# EAGLE schematic STEP800_r1_0_0 (EAGLE 9.6.2)

## Sheet 1 of 3
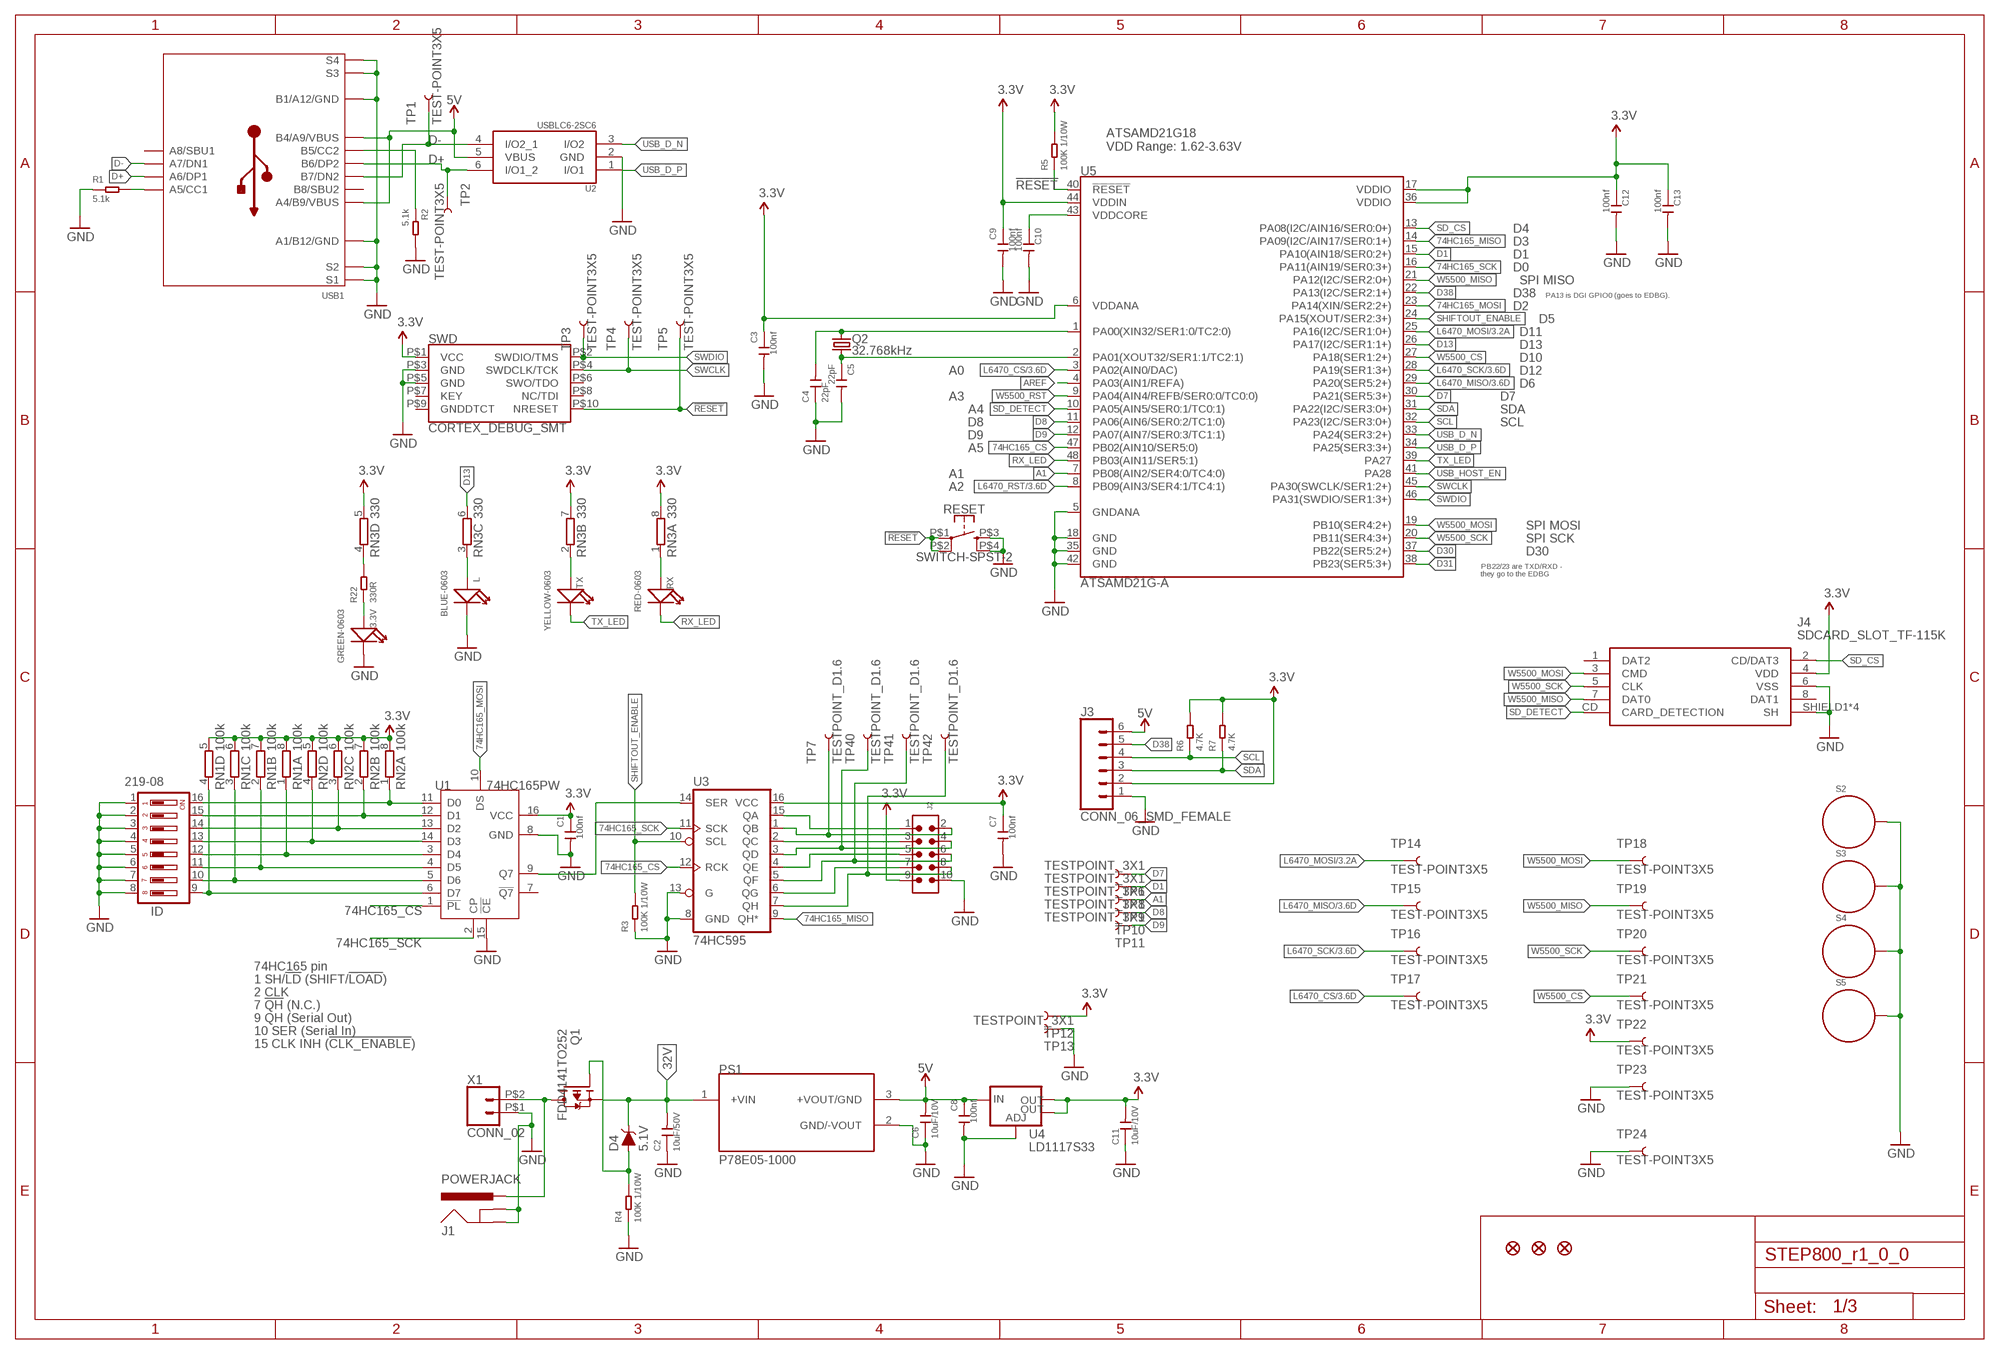
[diagram p0: schematic, sheet 1]

### Parts
3.3V  GREEN-0603  SMD-LED-CLEAR-GREEN(0603)  [LED-0603]
C1  100nf  CERAMIC-100NF-25V-10%-X7R(0402)  [C0402]
C2  10uF/50V  CERAMIC-10UF-25V-10%-X5R(1206)  [C1206]
C3  100nf  CERAMIC-100NF-25V-10%-X7R(0402)  [C0402]
C4  22pF  CERAMIC-15PF-50V-5%-NPO(0402)  [C0402]
C5  22pF  CERAMIC-15PF-50V-5%-NPO(0402)  [C0402]
C6  10uF/10V  CERAMIC-22UF-16V-10%-X7R(1206)  [C1206]
C7  100nf  CERAMIC-100NF-25V-10%-X7R(0402)  [C0402]
C8  100nf  CERAMIC-100NF-25V-10%-X7R(0402)  [C0402]
C9  100nf  CERAMIC-100NF-25V-10%-X7R(0402)  [C0402]
C10  100nf  CERAMIC-100NF-25V-10%-X7R(0402)  [C0402]
C11  10uF/10V  CERAMIC-10UF-10V-(-20%～+80%)-Y5V(0805)  [C0805]
C12  100nf  CERAMIC-100NF-25V-10%-X7R(0402)  [C0402]
C13  100nf  CERAMIC-100NF-25V-10%-X7R(0402)  [C0402]
D4  5.1V  DIODE-ZENER-MM3Z3V3T1G  [SOD-323]
FD1  FIDUCIAL1X2  [FIDUCIAL-1X2]
FD2  FIDUCIAL1X2  [FIDUCIAL-1X2]
FD3  FIDUCIAL1X2  [FIDUCIAL-1X2]
ID  219-08  [CTS-219-08]
J1  POWERJACK  [POWERJACK_SLOT]
J2  6120XX21621_61201021621  [61201021621]
J3  CONN_06_SMD_FEMALE  [1X06-SMD-FEMALE]
J4  SDCARD_SLOT_TF-115K  [TF-115K]
L  BLUE-0603  SMD-LED-CLEAR-BLUE(0603)  [LED-0603]
PS1  P78E05-1000  [CONV_P78E05-1000]
Q1  FDD4141TO252  [TO252]
Q2  32.768kHz  CRYSTALFC-135  [FC-135]
R1  5.1k  SMD-RES-5.1K-1%-1/10W(0603)  [R0603]
R2  5.1k  SMD-RES-5.1K-1%-1/10W(0603)  [R0603]
R3  100K 1/10W  SMD-RES-10K-5%-1/10W(0603)  [R0603]
R4  100K 1/10W  SMD-RES-100K-5%-1/10W(0603)  [R0603]
R5  100K 1/10W  SMD-RES-10K-5%-1/10W(0603)  [R0603]
R6  4.7K  SMD-RES-4.7K-5%-1/10W(0603)  [R0603]
R7  4.7K  SMD-RES-4.7K-5%-1/10W(0603)  [R0603]
R22  330R  SMD-RES-330R-1%-1/10W(0603)  [R0603]
RESET  SWITCH-SPST-2  [SKRP]
RN1  100k  4R-NCAY16_LONG_W  [CAY16_LONG_W]
RN2  100k  4R-NCAY16_LONG_W  [CAY16_LONG_W]
RN3  330  4R-NCAY16_LONG_W  [CAY16_LONG_W]
RX  RED-0603  LED-SMD-RED-DIFFUSED(0603)  [LED-0603]
S2  STANDOFF_ELECTRICAL  [STANDOFF-ELECTRICAL]
S3  STANDOFF_ELECTRICAL  [STANDOFF-ELECTRICAL]
S4  STANDOFF_ELECTRICAL  [STANDOFF-ELECTRICAL]
S5  STANDOFF_ELECTRICAL  [STANDOFF-ELECTRICAL]
SWD  CORTEX_DEBUG_SMT  [20021121-00010C4LF]
TP1  TEST-POINT3X5  [PAD.03X.05]
TP2  TEST-POINT3X5  [PAD.03X.05]
TP3  TEST-POINT3X5  [PAD.03X.05]
TP4  TEST-POINT3X5  [PAD.03X.05]
TP5  TEST-POINT3X5  [PAD.03X.05]
TP6  TESTPOINT_3X1  [TESTPOINT_3X1]
TP7  TESTPOINT_D1.6  [TESTPOINT_D1.6]
TP8  TESTPOINT_3X1  [TESTPOINT_3X1]
TP9  TESTPOINT_3X1  [TESTPOINT_3X1]
TP10  TESTPOINT_3X1  [TESTPOINT_3X1]
TP11  TESTPOINT_3X1  [TESTPOINT_3X1]
TP12  TESTPOINT_3X1  [TESTPOINT_3X1]
TP13  TESTPOINT_3X1  [TESTPOINT_3X1]
TP14  TEST-POINT3X5  [PAD.03X.05]
TP15  TEST-POINT3X5  [PAD.03X.05]
TP16  TEST-POINT3X5  [PAD.03X.05]
TP17  TEST-POINT3X5  [PAD.03X.05]
TP18  TEST-POINT3X5  [PAD.03X.05]
TP19  TEST-POINT3X5  [PAD.03X.05]
TP20  TEST-POINT3X5  [PAD.03X.05]
TP21  TEST-POINT3X5  [PAD.03X.05]
TP22  TEST-POINT3X5  [PAD.03X.05]
TP23  TEST-POINT3X5  [PAD.03X.05]
TP24  TEST-POINT3X5  [PAD.03X.05]
TP40  TESTPOINT_D1.6  [TESTPOINT_D1.6]
TP41  TESTPOINT_D1.6  [TESTPOINT_D1.6]
TP42  TESTPOINT_D1.6  [TESTPOINT_D1.6]
TX  YELLOW-0603  SMD-LED-CLEAR-YELLOW(0603)  [LED-0603]
U1  74HC165PW  [TSSOP16]
U2  USBLC6-2SC6  [SOT23-6L]
U3  74HC595  74595  [TSSOP16]
U4  LD1117S33  V_REG_LM1117SOT223  [SOT223]
U5  ATSAMD21G-A  [TQFP-48]
USB1  USB-C_USB2.0-TYPE-C  [USB-C_USB2.0-TYPE-C]
X1  CONN_02  [WJ25C-B-7.62-2P]

### Nets
3.3V [GND_]: C1.1 C3.1 C7.1 C9.1 C11.2 C12.1 C13.1 J2.9 J3.2 J4.4(VDD) R5.2 R6.2 R7.2 RN1.5 RN1.6 RN1.7 RN1.8 RN2.5 RN2.6 RN2.7 RN2.8 RN3.5 RN3.7 RN3.8 SWD.P$1(VCC) TP12.P$1 TP22.P$1 U1.16(VCC) U3.16(VCC) U4.2(OUT) U4.4(OUT) U5.6(VDDANA) U5.17(VDDIO) U5.36(VDDIO) U5.44(VDDIN) ; also sheet 2,3
5V: C6.2 C8.1 J3.6 PS1.3(+VOUT/GND) U2.5(VBUS) U4.3(IN) USB1.A4_B9(A4/B9/VBUS) USB1.B4_A9(B4/A9/VBUS) ; also sheet 3
32V: C2.2 D4.C PS1.1(+VIN) Q1.2(S) ; also sheet 3
74HC165_CS: U1.1(!PL) U3.12(RCK) U5.47(PB02(AIN10/SER5:0))
74HC165_MISO: U3.9(QH*) U5.14(PA09(I2C/AIN17/SER0:1+))
74HC165_MOSI: U1.10(DS) U5.23(PA14(XIN/SER2:2+))
74HC165_SCK: U1.2(CP) U3.11(SCK) U5.16(PA11(AIN19/SER0:3+))
!RESET: R5.1 RESET.P$1 RESET.P$2 SWD.P$10(NRESET) TP5.P$1 U5.40(!RESET!)
A1: TP9.P$1 U5.7(PB08(AIN2/SER4:0/TC4:0))
AREF: U5.4(PA03(AIN1/REFA))
D1: TP8.P$1 U5.15(PA10(AIN18/SER0:2+))
D7: TP6.P$1 U5.30(PA21(SER5:3+))
D8: TP10.P$1 U5.11(PA06(AIN6/SER0:2/TC1:0))
D9: TP11.P$1 U5.12(PA07(AIN7/SER0:3/TC1:1))
D13: RN3.6 U5.26(PA17(I2C/SER1:1+))
D30: U5.37(PB22(SER5:2+))
D31: U5.38(PB23(SER5:3+))
D38: J3.5 U5.22(PA13(I2C/SER2:1+))
D+: TP2.P$1 U2.6(I/O1_2) USB1.A6(A6/DP1) USB1.B6(B6/DP2)
D-: TP1.P$1 U2.4(I/O2_1) USB1.A7(A7/DN1) USB1.B7(B7/DN2)
GND: 3.3V.- C1.2 C2.1 C3.2 C4.1 C5.2 C6.1 C7.2 C8.2 C9.2 C10.2 C11.1 C12.2 C13.2 ID.1 ID.2 ID.3 ID.4 ID.5 ID.6 ID.7 ID.8 J1.P$33(GNDBREAK) J1.P$34(GNDBREAK) J1.P$35(GNDBREAK) J1.P$36(GNDBREAK) J1.P$37(GNDBREAK) J1.P$38(GNDBREAK) J1.P$39(GNDBREAK) J1.P$40(GNDBREAK) J1.P$41(GNDBREAK) J1.P$42(GNDBREAK) J1.P$43(GNDBREAK) J1.P$44(GNDBREAK) J1.P$45(GNDBREAK) J1.P$46(GNDBREAK) J1.P$47(GNDBREAK) J1.P$48(GNDBREAK) J1.P$49(GNDBREAK) J1.P$50(GNDBREAK) J1.P$51(GNDBREAK) J1.P$52(GNDBREAK) J1.P$53(GNDBREAK) J1.P$54(GNDBREAK) J1.P$55(GNDBREAK) J1.P$56(GNDBREAK) J1.P$63(GND) J1.P$64(GND) J1.P$65(GND) J1.P$66(GND) J1.P$67(GND) J1.P$68(GND) J1.P$69(GND) J1.P$70(GND) J1.P$71(GND) J1.P$72(GND) J1.P$73(GND) J1.P$74(GND) J1.P$75(GND) J1.P$76(GND) J1.P$77(GND) J1.P$78(GND) J1.P$79(GND) J1.P$80(GND) J1.P$81(GND) J1.P$82(GND) J1.P$83(GND) J1.P$84(GND) J1.P$85(GND) J2.10 J3.1 J4.6(VSS) J4.SHIELD1(SH) J4.SHIELD2(SH) J4.SHIELD3(SH) J4.SHIELD4(SH) L.- PS1.2(GND/-VOUT) R1.1 R2.2 R3.1 R4.1 RESET.P$3 RESET.P$4 S2.P1 S3.P1 S4.P1 S5.P1 SWD.P$3(GND) SWD.P$5(GND) TP13.P$1 TP23.P$1 TP24.P$1 U1.8(GND) U1.15(!CE) U2.2(GND) U3.8(GND) U3.13(G) U4.1(ADJ) U5.5(GNDANA) U5.18(GND) U5.35(GND) U5.42(GND) USB1.A1_B12(A1/B12/GND) USB1.B1_A12(B1/A12/GND) USB1.S7(S1) USB1.S8(S1) USB1.S9(S1) USB1.S10(S1) USB1.S11(S1) USB1.S12(S1) USB1.S13(S1) USB1.S14(S1) USB1.S15(S1) USB1.S16(S3) USB1.S17(S3) USB1.S18(S3) USB1.S19(S3) USB1.S20(S3) USB1.S21(S3) USB1.S22(S3) USB1.S23(S3) USB1.S24(S3) USB1.S25(S3) USB1.S26(S3) USB1.S27(S3) USB1.S29(S2) USB1.S30(S2) USB1.S31(S2) USB1.S32(S2) USB1.S33(S2) USB1.S34(S2) USB1.S35(S2) USB1.S36(S2) USB1.S37(S4) USB1.S38(S4) USB1.S39(S4) USB1.S40(S4) USB1.S41(S4) USB1.S42(S4) USB1.S43(S4) USB1.S44(S4) USB1.S45(S4) USB1.S46(S4) USB1.S47(S4) USB1.S48(S4) X1.P$1 ; also sheet 2,3
L6470_CS: TP17.P$1 U5.3(PA02(AIN0/DAC)) ; also sheet 3
L6470_MISO: TP15.P$1 U5.29(PA20(SER5:2+)) ; also sheet 3
L6470_MOSI: TP14.P$1 U5.25(PA16(I2C/SER1:0+)) ; also sheet 3
L6470_RST: U5.8(PB09(AIN3/SER4:1/TC4:1)) ; also sheet 3
L6470_SCK: TP16.P$1 U5.28(PA19(SER1:3+)) ; also sheet 3
N$3: C4.2 Q2.P$2 U5.1(PA00(XIN32/SER1:0/TC2:0))
N$10: ID.16 RN2.1 U1.11(D0)
N$11: D4.A Q1.1(G) R4.2
N$12: ID.15 RN2.2 U1.12(D1)
N$13: ID.14 RN2.3 U1.13(D2)
N$14: C5.1 Q2.P$1 U5.2(PA01(XOUT32/SER1:1/TC2:1))
N$15: U1.9(Q7) U3.14(SER)
N$16: RN3.1 RX.+
N$17: ID.13 RN2.4 U1.14(D3)
N$18: ID.12 RN1.1 U1.3(D4)
N$19: ID.11 RN1.2 U1.4(D5)
N$25: RN3.2 TX.+
N$26: L.+ RN3.3
N$27: R22.2 RN3.4
N$28: J2.3 U3.2(QC)
N$33: ID.10 RN1.3 U1.5(D6)
N$34: J2.2 TP7.1 U3.1(QB)
N$36: J2.1 U3.15(QA)
N$38: ID.9 RN1.4 U1.6(D7)
N$40: J2.4 TP40.1 U3.3(QD)
N$41: J2.5 U3.4(QE)
N$42: J2.6 TP41.1 U3.5(QF)
N$43: J2.7 U3.6(QG)
N$44: J2.8 TP42.1 U3.7(QH)
N$45: R2.1 USB1.B5(B5/CC2)
N$46: 3.3V.+ R22.1
N$50: R1.2 USB1.A5(A5/CC1)
RX_LED: RX.- U5.48(PB03(AIN11/SER5:1))
SCL: J3.4 R6.1 U5.32(PA23(I2C/SER3:0+))
SD_CS: J4.2(CD/DAT3) U5.13(PA08(I2C/AIN16/SER0:0+))
SD_DETECT: J4.CD(CARD_DETECTION) U5.10(PA05(AIN5/SER0:1/TC0:1))
SDA: J3.3 R7.1 U5.31(PA22(I2C/SER3:0+))
SHIFTOUT_ENABLE: R3.2 U3.10(SCL) U5.24(PA15(XOUT/SER2:3+))
SWCLK: SWD.P$4(SWDCLK/TCK) TP4.P$1 U5.45(PA30(SWCLK/SER1:2+))
SWDIO: SWD.P$2(SWDIO/TMS) TP3.P$1 U5.46(PA31(SWDIO/SER1:3+))
TX_LED: TX.- U5.39(PA27)
USB_D_N: U2.3(I/O2) U5.33(PA24(SER3:2+))
USB_D_P: U2.1(I/O1) U5.34(PA25(SER3:3+))
USB_HOST_EN: U5.41(PA28)
VDDCORE1: C10.1 U5.43(VDDCORE)
VRAW: J1.P$2(PWR) J1.P$3(PWR) J1.P$4(PWR) J1.P$5(PWR) J1.P$6(PWR) J1.P$7(PWR) J1.P$8(PWR) J1.P$9(PWR) J1.P$10(PWR) J1.P$11(PWR) J1.P$12(PWR) J1.P$13(PWR) J1.P$14(PWR) J1.P$15(PWR) J1.P$16(PWR) J1.P$17(PWR) J1.P$18(PWR) J1.P$19(PWR) J1.P$20(PWR) J1.P$21(PWR) J1.P$22(PWR) J1.P$23(PWR) J1.P$24(PWR) J1.P$25(PWR) J1.P$26(PWR) J1.P$27(PWR) J1.P$28(PWR) Q1.3(D) X1.P$2
W5500_CS: TP21.P$1 U5.27(PA18(SER1:2+)) ; also sheet 2
W5500_MISO: J4.7(DAT0) TP19.P$1 U5.21(PA12(I2C/SER2:0+)) ; also sheet 2
W5500_MOSI: J4.3(CMD) TP18.P$1 U5.19(PB10(SER4:2+)) ; also sheet 2
W5500_RST: U5.9(PA04(AIN4/REFB/SER0:0/TC0:0)) ; also sheet 2
W5500_SCK: J4.5(CLK) TP20.P$1 U5.20(PB11(SER4:3+)) ; also sheet 2
Unconnected: J4.1(DAT2) J4.8(DAT1) SWD.P$6(SWO/TDO) SWD.P$7(KEY) SWD.P$8(NC/TDI) SWD.P$9(GNDDTCT) U1.7(!Q7) USB1.A8(A8/SBU1) USB1.B8(B8/SBU2)

### Notes on the sheet
- ATSAMD21G18
  VDD Range: 1.62-3.63V
- D4
- D3
- D1
- D0
- SPI MISO
- D38 | PA13 is DGI GPIO0 (goes to EDBG).
- D2
- D5
- D11
- D13
- D10
- A0 | D12
- D6
- A3 | D7
- A4 | SDA
- D8 | SCL
- D9
- A5
- A1
- A2
- SPI MOSI
- SPI SCK
- D30
- PB22/23 are TXD/RXD - 
  they go to the EDBG
- 74HC165 pin
- 1 SH/!LD! (SHIFT/!LOAD!)
- 2 CLK
- 7 !QH! (N.C.)
- 9 QH (Serial Out)
- 10 SER (Serial In)
- 15 CLK INH (!CLK_ENABLE!)

## Sheet 2 of 3
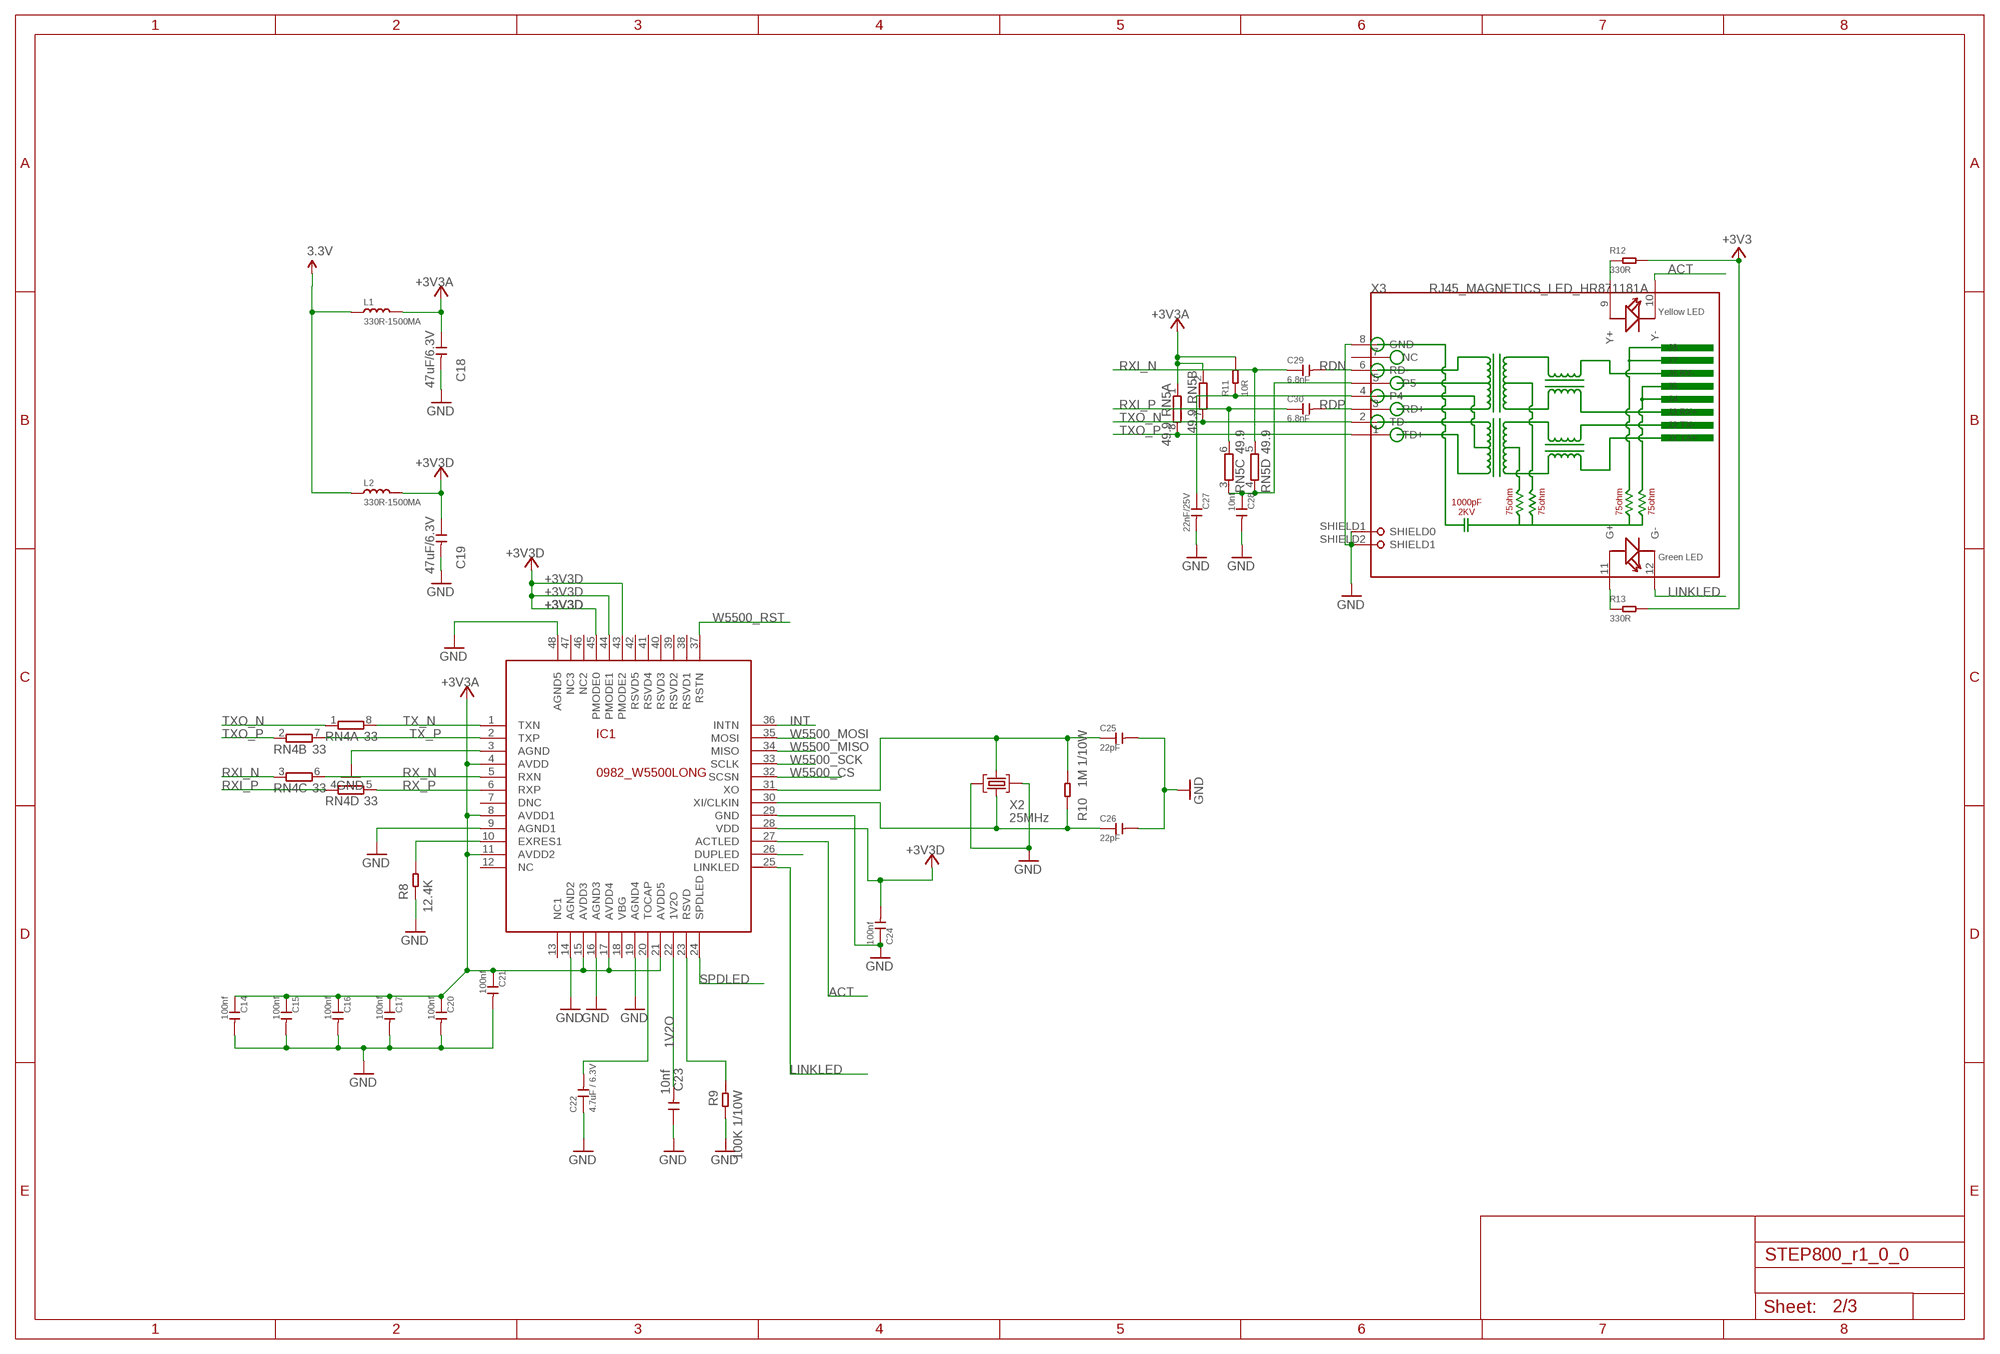
[diagram p1: schematic, sheet 2]

### Parts
C14  100nf  CERAMIC-100NF-25V-10%-X7R(0402)  [C0402]
C15  100nf  CERAMIC-100NF-25V-10%-X7R(0402)  [C0402]
C16  100nf  CERAMIC-100NF-25V-10%-X7R(0402)  [C0402]
C17  100nf  CERAMIC-100NF-25V-10%-X7R(0402)  [C0402]
C18  47uF/6.3V  CERAMIC-100UF-6.3V-20%-X5R(1206)  [C1206]
C19  47uF/6.3V  CERAMIC-100UF-6.3V-20%-X5R(1206)  [C1206]
C20  100nf  CERAMIC-100NF-25V-10%-X7R(0402)  [C0402]
C21  100nf  CERAMIC-100NF-25V-10%-X7R(0402)  [C0402]
C22  4.7uF / 6.3V  CERAMIC-4.7UF-10V-10%-X5R(0603)  [C0603]
C23  10nf  CERAMIC-10NF-50V-10%-X7R(0603)  [C0603]
C24  100nf  CERAMIC-100NF-25V-10%-X7R(0402)  [C0402]
C25  22pF  CERAMIC-15PF-50V-5%-NPO(0402)  [C0402]
C26  22pF  CERAMIC-15PF-50V-5%-NPO(0402)  [C0402]
C27  22nF/25V  CERAMIC-22NF-50V-10%-X7R(0402)  [C0402]
C28  10nf  CERAMIC-10NF-50V-10%-X7R(0603)  [C0603]
C29  6.8nF  CERAMIC-4.7NF-50V-10%-X7R(0402)  [C0402]
C30  6.8nF  CERAMIC-4.7NF-50V-10%-X7R(0402)  [C0402]
IC1  0982_W5500LONG  [TQFP48-LONG]
L1  330R-1500MA  SMD-FERRITE-BEAD-330R-1500MA(0805)'0805'  [L0805]
L2  330R-1500MA  SMD-FERRITE-BEAD-330R-1500MA(0805)'0805'  [L0805]
R8  12.4K  SMD-RES-12K-1%-1/10W(0603)  [R0603]
R9  100K 1/10W  SMD-RES-10K-5%-1/10W(0603)  [R0603]
R10  1M 1/10W  SMD-RES-1M-5%-1/10W(0603)  [R0603]
R11  10R  SMD-RES-10R-5%-1/10W(0603)  [R0603]
R12  330R  SMD-RES-330R-1%-1/10W(0603)  [R0603]
R13  330R  SMD-RES-330R-1%-1/10W(0603)  [R0603]
RN4  33  4R-NCAY16_LONG_W  [CAY16_LONG_W]
RN5  49.9  4R-NCAY16_LONG_W  [CAY16_LONG_W]
X2  25MHz  CRYSTAL-3.2-2.5  [CRYSTAL-3.2-2.5]
X3  RJ45_MAGNETICS_LED_HR871181A  [HR871181A]

### Nets
1V2O: C23.2 IC1.22(1V2O)
3.3V [GND_]: L1.1 L2.1 R12.2 R13.2 ; supply symbol labelled +3V3 ; also sheet 1,3
+3V3A [POWER_]: C14.1 C15.1 C16.1 C17.1 C18.1 C20.1 C21.1 IC1.4(AVDD) IC1.8(AVDD1) IC1.11(AVDD2) IC1.15(AVDD3) IC1.17(AVDD4) IC1.21(AVDD5) L1.2 R11.2 RN5.1 RN5.2
+3V3D: C19.1 C24.2 IC1.28(VDD) IC1.43(PMODE2) IC1.44(PMODE1) IC1.45(PMODE0) L2.2
ACT: IC1.27(ACTLED) X3.10(Y-)
FDXLED1: IC1.26(DUPLED)
GND: C14.2 C15.2 C16.2 C17.2 C18.2 C19.2 C20.2 C21.2 C22.1 C23.1 C24.1 C25.2 C26.2 C27.2 C28.2 IC1.3(AGND) IC1.9(AGND1) IC1.14(AGND2) IC1.16(AGND3) IC1.19(AGND4) IC1.29(GND) IC1.48(AGND5) R8.1 R9.1 X2.2(GND) X2.4(GND) X3.8(GND) X3.SHIELD1(SHIELD0) X3.SHIELD2(SHIELD1) ; also sheet 1,3
INT: IC1.36(INTN)
LINKLED: IC1.25(LINKLED) X3.12(G-)
N$1: C25.1 IC1.31(XO) R10.1 X2.3(C2)
N$2: IC1.23(RSVD) R9.2
N$4: IC1.10(EXRES1) R8.2
N$5: C22.2 IC1.20(TOCAP)
N$6: C27.1 R11.1 X3.4
N$7: C28.1 RN5.3 RN5.4 X3.5
N$8: R12.1 X3.9(Y+)
N$9: R13.1 X3.11(G+)
OSC2E1: C26.1 IC1.30(XI/CLKIN) R10.2 X2.1(C1)
RDN: C29.2 X3.6(RD-)
RDP: C30.2 X3.3(RD+)
RX_N: IC1.5(RXN) RN4.6
RX_P: IC1.6(RXP) RN4.5
RXI_N: C29.1 RN4.3 RN5.5
RXI_P: C30.1 RN4.4 RN5.6
SPDLED: IC1.24(SPDLED)
TX_N: IC1.1(TXN) RN4.8
TX_P: IC1.2(TXP) RN4.7
TXO_N: RN4.1 RN5.7 X3.2(TD-)
TXO_P: RN4.2 RN5.8 X3.1(TD+)
W5500_CS: IC1.32(SCSN) ; also sheet 1
W5500_MISO: IC1.34(MISO) ; also sheet 1
W5500_MOSI: IC1.35(MOSI) ; also sheet 1
W5500_RST: IC1.37(RSTN) ; also sheet 1
W5500_SCK: IC1.33(SCLK) ; also sheet 1
Unconnected: IC1.7(DNC) IC1.13(NC1) IC1.18(VBG) IC1.41(RSVD4) IC1.42(RSVD5) IC1.46(NC2) IC1.47(NC3) X3.7(NC)

## Sheet 3 of 3
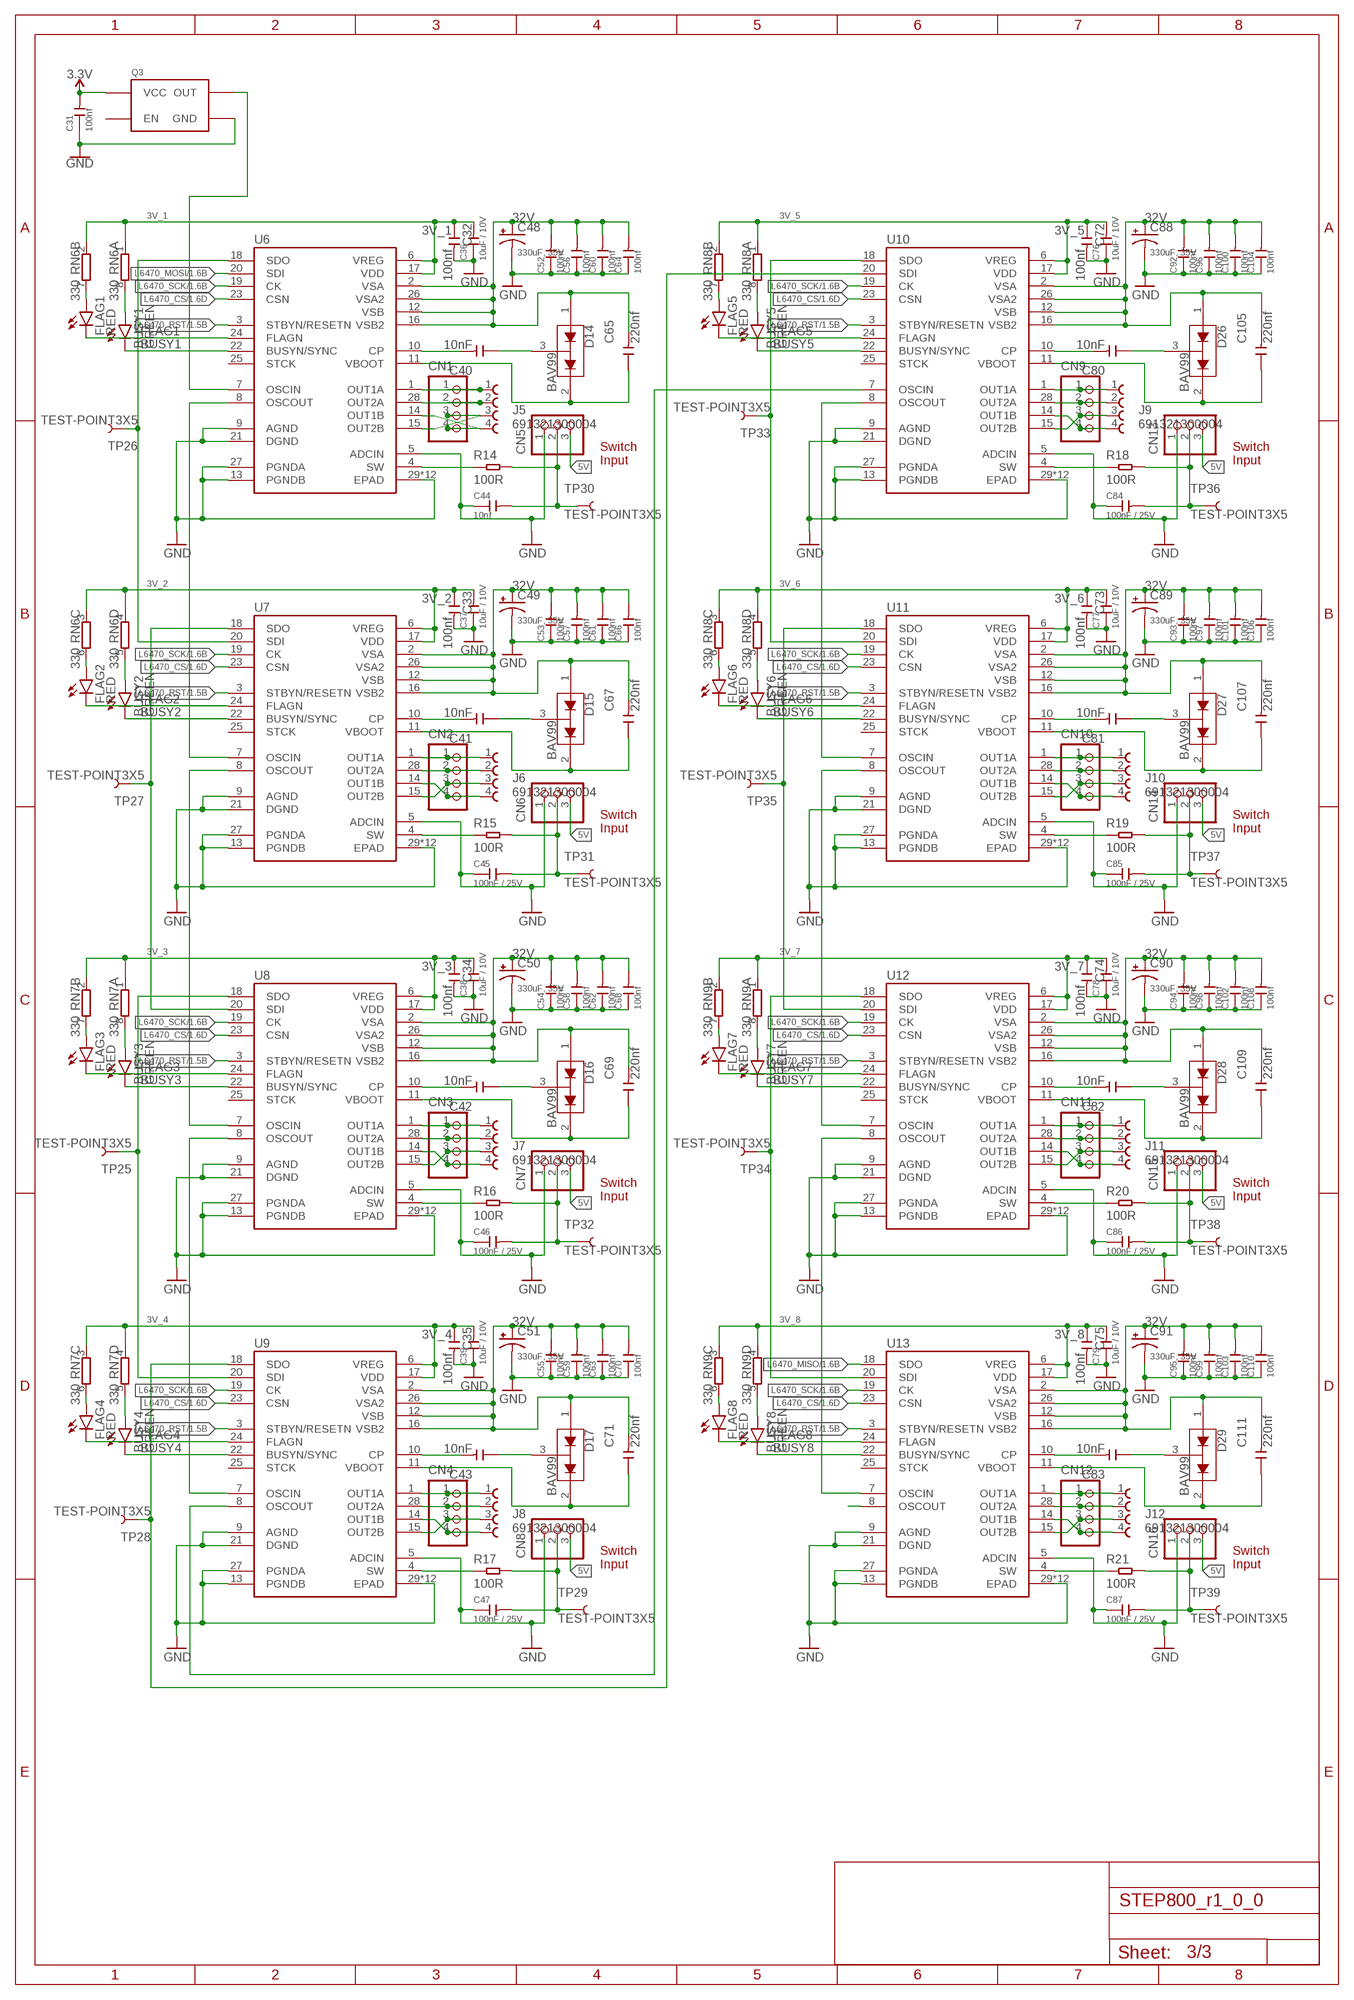
[diagram p2: schematic, sheet 3]

### Parts
BUSY1  GREEN  LED-GREEN0603  [LED-0603]
BUSY2  GREEN  LED-GREEN0603  [LED-0603]
BUSY3  GREEN  LED-GREEN0603  [LED-0603]
BUSY4  GREEN  LED-GREEN0603  [LED-0603]
BUSY5  GREEN  LED-GREEN0603  [LED-0603]
BUSY6  GREEN  LED-GREEN0603  [LED-0603]
BUSY7  GREEN  LED-GREEN0603  [LED-0603]
BUSY8  GREEN  LED-GREEN0603  [LED-0603]
C31  100nf  CERAMIC-100NF-25V-10%-X7R(0402)  [C0402]
C32  100nf  CERAMIC-100NF-25V-10%-X7R(0402)  [C0402]
C33  100nf  CERAMIC-100NF-25V-10%-X7R(0402)  [C0402]
C34  100nf  CERAMIC-100NF-25V-10%-X7R(0402)  [C0402]
C35  100nf  CERAMIC-100NF-25V-10%-X7R(0402)  [C0402]
C36  10uF / 10V  CERAMIC-10UF-25V-10%-X5R(0805)  [C0805]
C37  10uF / 10V  CERAMIC-10UF-25V-10%-X5R(0805)  [C0805]
C38  10uF / 10V  CERAMIC-10UF-25V-10%-X5R(0805)  [C0805]
C39  10uF / 10V  CERAMIC-10UF-25V-10%-X5R(0805)  [C0805]
C40  10nF  CERAMIC-220NF-25V-10%-X7R(0603)  [C0603]
C41  10nF  CERAMIC-220NF-25V-10%-X7R(0603)  [C0603]
C42  10nF  CERAMIC-220NF-25V-10%-X7R(0603)  [C0603]
C43  10nF  CERAMIC-220NF-25V-10%-X7R(0603)  [C0603]
C44  10nf  CERAMIC-10NF-50V-10%-X7R(0402)  [C0402]
C45  100nF / 25V  CERAMIC-10NF-50V-10%-X7R(0402)  [C0402]
C46  100nF / 25V  CERAMIC-10NF-50V-10%-X7R(0402)  [C0402]
C47  100nF / 25V  CERAMIC-10NF-50V-10%-X7R(0402)  [C0402]
C48  330uF, 35V  C_POLD10  [NICHICON_D10]
C49  330uF, 35V  C_POLD10  [NICHICON_D10]
C50  330uF, 35V  C_POLD10  [NICHICON_D10]
C51  330uF, 35V  C_POLD10  [NICHICON_D10]
C52  100nf  CERAMIC-100NF-50V-10%-X7R(0603)  [C0603]
C53  100nf  CERAMIC-100NF-50V-10%-X7R(0603)  [C0603]
C54  100nf  CERAMIC-100NF-50V-10%-X7R(0603)  [C0603]
C55  100nf  CERAMIC-100NF-50V-10%-X7R(0603)  [C0603]
C56  100nf  CERAMIC-100NF-50V-10%-X7R(0603)  [C0603]
C57  100nf  CERAMIC-100NF-50V-10%-X7R(0603)  [C0603]
C58  100nf  CERAMIC-100NF-50V-10%-X7R(0603)  [C0603]
C59  100nf  CERAMIC-100NF-50V-10%-X7R(0603)  [C0603]
C60  100nf  CERAMIC-100NF-50V-10%-X7R(0603)  [C0603]
C61  100nf  CERAMIC-100NF-50V-10%-X7R(0603)  [C0603]
C62  100nf  CERAMIC-100NF-50V-10%-X7R(0603)  [C0603]
C63  100nf  CERAMIC-100NF-50V-10%-X7R(0603)  [C0603]
C64  100nf  CERAMIC-100NF-50V-10%-X7R(0603)  [C0603]
C65  220nf  CERAMIC-220NF-25V-10%-X7R(0603)  [C0603]
C66  100nf  CERAMIC-100NF-50V-10%-X7R(0603)  [C0603]
C67  220nf  CERAMIC-220NF-25V-10%-X7R(0603)  [C0603]
C68  100nf  CERAMIC-100NF-50V-10%-X7R(0603)  [C0603]
C69  220nf  CERAMIC-220NF-25V-10%-X7R(0603)  [C0603]
C70  100nf  CERAMIC-100NF-50V-10%-X7R(0603)  [C0603]
C71  220nf  CERAMIC-220NF-25V-10%-X7R(0603)  [C0603]
C72  100nf  CERAMIC-100NF-25V-10%-X7R(0402)  [C0402]
C73  100nf  CERAMIC-100NF-25V-10%-X7R(0402)  [C0402]
C74  100nf  CERAMIC-100NF-25V-10%-X7R(0402)  [C0402]
C75  100nf  CERAMIC-100NF-25V-10%-X7R(0402)  [C0402]
C76  10uF / 10V  CERAMIC-10UF-25V-10%-X5R(0805)  [C0805]
C77  10uF / 10V  CERAMIC-10UF-25V-10%-X5R(0805)  [C0805]
C78  10uF / 10V  CERAMIC-10UF-25V-10%-X5R(0805)  [C0805]
C79  10uF / 10V  CERAMIC-10UF-25V-10%-X5R(0805)  [C0805]
C80  10nF  CERAMIC-220NF-25V-10%-X7R(0603)  [C0603]
C81  10nF  CERAMIC-220NF-25V-10%-X7R(0603)  [C0603]
C82  10nF  CERAMIC-220NF-25V-10%-X7R(0603)  [C0603]
C83  10nF  CERAMIC-220NF-25V-10%-X7R(0603)  [C0603]
C84  100nF / 25V  CERAMIC-10NF-50V-10%-X7R(0402)  [C0402]
C85  100nF / 25V  CERAMIC-10NF-50V-10%-X7R(0402)  [C0402]
C86  100nF / 25V  CERAMIC-10NF-50V-10%-X7R(0402)  [C0402]
C87  100nF / 25V  CERAMIC-10NF-50V-10%-X7R(0402)  [C0402]
C88  330uF, 35V  C_POLD10  [NICHICON_D10]
C89  330uF, 35V  C_POLD10  [NICHICON_D10]
C90  330uF, 35V  C_POLD10  [NICHICON_D10]
C91  330uF, 35V  C_POLD10  [NICHICON_D10]
C92  100nf  CERAMIC-100NF-50V-10%-X7R(0603)  [C0603]
C93  100nf  CERAMIC-100NF-50V-10%-X7R(0603)  [C0603]
C94  100nf  CERAMIC-100NF-50V-10%-X7R(0603)  [C0603]
C95  100nf  CERAMIC-100NF-50V-10%-X7R(0603)  [C0603]
C96  100nf  CERAMIC-100NF-50V-10%-X7R(0603)  [C0603]
C97  100nf  CERAMIC-100NF-50V-10%-X7R(0603)  [C0603]
C98  100nf  CERAMIC-100NF-50V-10%-X7R(0603)  [C0603]
C99  100nf  CERAMIC-100NF-50V-10%-X7R(0603)  [C0603]
C100  100nf  CERAMIC-100NF-50V-10%-X7R(0603)  [C0603]
C101  100nf  CERAMIC-100NF-50V-10%-X7R(0603)  [C0603]
C102  100nf  CERAMIC-100NF-50V-10%-X7R(0603)  [C0603]
C103  100nf  CERAMIC-100NF-50V-10%-X7R(0603)  [C0603]
C104  100nf  CERAMIC-100NF-50V-10%-X7R(0603)  [C0603]
C105  220nf  CERAMIC-220NF-25V-10%-X7R(0603)  [C0603]
C106  100nf  CERAMIC-100NF-50V-10%-X7R(0603)  [C0603]
C107  220nf  CERAMIC-220NF-25V-10%-X7R(0603)  [C0603]
C108  100nf  CERAMIC-100NF-50V-10%-X7R(0603)  [C0603]
C109  220nf  CERAMIC-220NF-25V-10%-X7R(0603)  [C0603]
C110  100nf  CERAMIC-100NF-50V-10%-X7R(0603)  [C0603]
C111  220nf  CERAMIC-220NF-25V-10%-X7R(0603)  [C0603]
CN1  B4B-XASK-1  [B4B-XASK-1]
CN2  B4B-XASK-1  [B4B-XASK-1]
CN3  B4B-XASK-1  [B4B-XASK-1]
CN4  B4B-XASK-1  [B4B-XASK-1]
CN5  B3B-XASK-1  [B3B-XASK-1]
CN6  B3B-XASK-1  [B3B-XASK-1]
CN7  B3B-XASK-1  [B3B-XASK-1]
CN8  B3B-XASK-1  [B3B-XASK-1]
CN9  B4B-XASK-1  [B4B-XASK-1]
CN10  B4B-XASK-1  [B4B-XASK-1]
CN11  B4B-XASK-1  [B4B-XASK-1]
CN12  B4B-XASK-1  [B4B-XASK-1]
CN13  B3B-XASK-1  [B3B-XASK-1]
CN14  B3B-XASK-1  [B3B-XASK-1]
CN15  B3B-XASK-1  [B3B-XASK-1]
CN16  B3B-XASK-1  [B3B-XASK-1]
D14  BAV99  [SOT23-3]
D15  BAV99  [SOT23-3]
D16  BAV99  [SOT23-3]
D17  BAV99  [SOT23-3]
D26  BAV99  [SOT23-3]
D27  BAV99  [SOT23-3]
D28  BAV99  [SOT23-3]
D29  BAV99  [SOT23-3]
FLAG1  RED  LED-RED0603  [LED-0603]
FLAG2  RED  LED-RED0603  [LED-0603]
FLAG3  RED  LED-RED0603  [LED-0603]
FLAG4  RED  LED-RED0603  [LED-0603]
FLAG5  RED  LED-RED0603  [LED-0603]
FLAG6  RED  LED-RED0603  [LED-0603]
FLAG7  RED  LED-RED0603  [LED-0603]
FLAG8  RED  LED-RED0603  [LED-0603]
J5  691321300004  [691321300004]
J6  691321300004  [691321300004]
J7  691321300004  [691321300004]
J8  691321300004  [691321300004]
J9  691321300004  [691321300004]
J10  691321300004  [691321300004]
J11  691321300004  [691321300004]
J12  691321300004  [691321300004]
Q3  CRYSTAL_OSC_SG5032  [SG5032]
R14  100R  SMD-RES-100R-5%-1/10W(0603)  [R0603]
R15  100R  SMD-RES-100R-5%-1/10W(0603)  [R0603]
R16  100R  SMD-RES-100R-5%-1/10W(0603)  [R0603]
R17  100R  SMD-RES-100R-5%-1/10W(0603)  [R0603]
R18  100R  SMD-RES-100R-5%-1/10W(0603)  [R0603]
R19  100R  SMD-RES-100R-5%-1/10W(0603)  [R0603]
R20  100R  SMD-RES-100R-5%-1/10W(0603)  [R0603]
R21  100R  SMD-RES-100R-5%-1/10W(0603)  [R0603]
RN6  330  4R-NCAY16_LONG_W  [CAY16_LONG_W]
RN7  330  4R-NCAY16_LONG_W  [CAY16_LONG_W]
RN8  330  4R-NCAY16_LONG_W  [CAY16_LONG_W]
RN9  330  4R-NCAY16_LONG_W  [CAY16_LONG_W]
TP25  TEST-POINT3X5  [PAD.03X.05]
TP26  TEST-POINT3X5  [PAD.03X.05]
TP27  TEST-POINT3X5  [PAD.03X.05]
TP28  TEST-POINT3X5  [PAD.03X.05]
TP29  TEST-POINT3X5  [PAD.03X.05]
TP30  TEST-POINT3X5  [PAD.03X.05]
TP31  TEST-POINT3X5  [PAD.03X.05]
TP32  TEST-POINT3X5  [PAD.03X.05]
TP33  TEST-POINT3X5  [PAD.03X.05]
TP34  TEST-POINT3X5  [PAD.03X.05]
TP35  TEST-POINT3X5  [PAD.03X.05]
TP36  TEST-POINT3X5  [PAD.03X.05]
TP37  TEST-POINT3X5  [PAD.03X.05]
TP38  TEST-POINT3X5  [PAD.03X.05]
TP39  TEST-POINT3X5  [PAD.03X.05]
U6  L6470_THERMALVIA  [HTSSOP28_VIA]
U7  L6470_THERMALVIA  [HTSSOP28_VIA]
U8  L6470_THERMALVIA  [HTSSOP28_VIA]
U9  L6470_THERMALVIA  [HTSSOP28_VIA]
U10  L6470_THERMALVIA  [HTSSOP28_VIA]
U11  L6470_THERMALVIA  [HTSSOP28_VIA]
U12  L6470_THERMALVIA  [HTSSOP28_VIA]
U13  L6470_THERMALVIA  [HTSSOP28_VIA]

### Nets
3.3V [GND_]: C31.2 Q3.4(VCC) ; also sheet 1,2
3V_1 [GND_]: C32.1 C36.2 RN6.1 RN6.2 U6.6(VREG) U6.17(VDD)
3V_2 [GND_]: C33.1 C37.2 RN6.3 RN6.4 U7.6(VREG) U7.17(VDD)
3V_3 [GND_]: C34.1 C38.2 RN7.1 RN7.2 U8.6(VREG) U8.17(VDD)
3V_4 [GND_]: C35.1 C39.2 RN7.3 RN7.4 U9.6(VREG) U9.17(VDD)
3V_5 [GND_]: C72.1 C76.2 RN8.1 RN8.2 U10.6(VREG) U10.17(VDD)
3V_6 [GND_]: C73.1 C77.2 RN8.3 RN8.4 U11.6(VREG) U11.17(VDD)
3V_7 [GND_]: C74.1 C78.2 RN9.1 RN9.2 U12.6(VREG) U12.17(VDD)
3V_8 [GND_]: C75.1 C79.2 RN9.3 RN9.4 U13.6(VREG) U13.17(VDD)
5V: CN5.3 CN6.3 CN7.3 CN8.3 CN13.3 CN14.3 CN15.3 CN16.3 ; also sheet 1
32V: C48.+ C49.+ C50.+ C51.+ C52.2 C53.2 C54.2 C55.2 C56.2 C57.2 C58.2 C59.2 C60.2 C61.2 C62.2 C63.2 C64.2 C65.2 C66.2 C67.2 C68.2 C69.2 C70.2 C71.2 C88.+ C89.+ C90.+ C91.+ C92.2 C93.2 C94.2 C95.2 C96.2 C97.2 C98.2 C99.2 C100.2 C101.2 C102.2 C103.2 C104.2 C105.2 C106.2 C107.2 C108.2 C109.2 C110.2 C111.2 D14.1(A1) D15.1(A1) D16.1(A1) D17.1(A1) D26.1(A1) D27.1(A1) D28.1(A1) D29.1(A1) U6.2(VSA) U6.12(VSB) U6.16(VSB2) U6.26(VSA2) U7.2(VSA) U7.12(VSB) U7.16(VSB2) U7.26(VSA2) U8.2(VSA) U8.12(VSB) U8.16(VSB2) U8.26(VSA2) U9.2(VSA) U9.12(VSB) U9.16(VSB2) U9.26(VSA2) U10.2(VSA) U10.12(VSB) U10.16(VSB2) U10.26(VSA2) U11.2(VSA) U11.12(VSB) U11.16(VSB2) U11.26(VSA2) U12.2(VSA) U12.12(VSB) U12.16(VSB2) U12.26(VSA2) U13.2(VSA) U13.12(VSB) U13.16(VSB2) U13.26(VSA2) ; also sheet 1
BUSY1: BUSY1.C U6.22(BUSYN/SYNC)
BUSY2: BUSY2.C U7.22(BUSYN/SYNC)
BUSY3: BUSY3.C U8.22(BUSYN/SYNC)
BUSY4: BUSY4.C U9.22(BUSYN/SYNC)
BUSY5: BUSY5.C U10.22(BUSYN/SYNC)
BUSY6: BUSY6.C U11.22(BUSYN/SYNC)
BUSY7: BUSY7.C U12.22(BUSYN/SYNC)
BUSY8: BUSY8.C U13.22(BUSYN/SYNC)
FLAG1: FLAG1.C U6.24(FLAGN)
FLAG2: FLAG2.C U7.24(FLAGN)
FLAG3: FLAG3.C U8.24(FLAGN)
FLAG4: FLAG4.C U9.24(FLAGN)
FLAG5: FLAG5.C U10.24(FLAGN)
FLAG6: FLAG6.C U11.24(FLAGN)
FLAG7: FLAG7.C U12.24(FLAGN)
FLAG8: FLAG8.C U13.24(FLAGN)
GND: C31.1 C32.2 C33.2 C34.2 C35.2 C36.1 C37.1 C38.1 C39.1 C44.1 C45.1 C46.1 C47.1 C48.- C49.- C50.- C51.- C52.1 C53.1 C54.1 C55.1 C56.1 C57.1 C58.1 C59.1 C60.1 C61.1 C62.1 C63.1 C64.1 C66.1 C68.1 C70.1 C72.2 C73.2 C74.2 C75.2 C76.1 C77.1 C78.1 C79.1 C84.1 C85.1 C86.1 C87.1 C88.- C89.- C90.- C91.- C92.1 C93.1 C94.1 C95.1 C96.1 C97.1 C98.1 C99.1 C100.1 C101.1 C102.1 C103.1 C104.1 C106.1 C108.1 C110.1 CN5.1 CN6.1 CN7.1 CN8.1 CN13.1 CN14.1 CN15.1 CN16.1 Q3.2(GND) U6.5(ADCIN) U6.9(AGND) U6.13(PGNDB) U6.21(DGND) U6.27(PGNDA) U6.29(EPAD) U6.VIA1(EPAD) U6.VIA2(EPAD) U6.VIA3(EPAD) U6.VIA4(EPAD) U6.VIA5(EPAD) U6.VIA6(EPAD) U6.VIA7(EPAD) U6.VIA8(EPAD) U6.VIA9(EPAD) U6.VIA10(EPAD) U6.VIA11(EPAD) U7.5(ADCIN) U7.9(AGND) U7.13(PGNDB) U7.21(DGND) U7.27(PGNDA) U7.29(EPAD) U7.VIA1(EPAD) U7.VIA2(EPAD) U7.VIA3(EPAD) U7.VIA4(EPAD) U7.VIA5(EPAD) U7.VIA6(EPAD) U7.VIA7(EPAD) U7.VIA8(EPAD) U7.VIA9(EPAD) U7.VIA10(EPAD) U7.VIA11(EPAD) U8.5(ADCIN) U8.9(AGND) U8.13(PGNDB) U8.21(DGND) U8.27(PGNDA) U8.29(EPAD) U8.VIA1(EPAD) U8.VIA2(EPAD) U8.VIA3(EPAD) U8.VIA4(EPAD) U8.VIA5(EPAD) U8.VIA6(EPAD) U8.VIA7(EPAD) U8.VIA8(EPAD) U8.VIA9(EPAD) U8.VIA10(EPAD) U8.VIA11(EPAD) U9.5(ADCIN) U9.9(AGND) U9.13(PGNDB) U9.21(DGND) U9.27(PGNDA) U9.29(EPAD) U9.VIA1(EPAD) U9.VIA2(EPAD) U9.VIA3(EPAD) U9.VIA4(EPAD) U9.VIA5(EPAD) U9.VIA6(EPAD) U9.VIA7(EPAD) U9.VIA8(EPAD) U9.VIA9(EPAD) U9.VIA10(EPAD) U9.VIA11(EPAD) U10.5(ADCIN) U10.9(AGND) U10.13(PGNDB) U10.21(DGND) U10.27(PGNDA) U10.29(EPAD) U10.VIA1(EPAD) U10.VIA2(EPAD) U10.VIA3(EPAD) U10.VIA4(EPAD) U10.VIA5(EPAD) U10.VIA6(EPAD) U10.VIA7(EPAD) U10.VIA8(EPAD) U10.VIA9(EPAD) U10.VIA10(EPAD) U10.VIA11(EPAD) U11.5(ADCIN) U11.9(AGND) U11.13(PGNDB) U11.21(DGND) U11.27(PGNDA) U11.29(EPAD) U11.VIA1(EPAD) U11.VIA2(EPAD) U11.VIA3(EPAD) U11.VIA4(EPAD) U11.VIA5(EPAD) U11.VIA6(EPAD) U11.VIA7(EPAD) U11.VIA8(EPAD) U11.VIA9(EPAD) U11.VIA10(EPAD) U11.VIA11(EPAD) U12.5(ADCIN) U12.9(AGND) U12.13(PGNDB) U12.21(DGND) U12.27(PGNDA) U12.29(EPAD) U12.VIA1(EPAD) U12.VIA2(EPAD) U12.VIA3(EPAD) U12.VIA4(EPAD) U12.VIA5(EPAD) U12.VIA6(EPAD) U12.VIA7(EPAD) U12.VIA8(EPAD) U12.VIA9(EPAD) U12.VIA10(EPAD) U12.VIA11(EPAD) U13.5(ADCIN) U13.9(AGND) U13.13(PGNDB) U13.21(DGND) U13.27(PGNDA) U13.29(EPAD) U13.VIA1(EPAD) U13.VIA2(EPAD) U13.VIA3(EPAD) U13.VIA4(EPAD) U13.VIA5(EPAD) U13.VIA6(EPAD) U13.VIA7(EPAD) U13.VIA8(EPAD) U13.VIA9(EPAD) U13.VIA10(EPAD) U13.VIA11(EPAD) ; also sheet 1,2
L6470_CS: U6.23(CSN) U7.23(CSN) U8.23(CSN) U9.23(CSN) U10.23(CSN) U11.23(CSN) U12.23(CSN) U13.23(CSN) ; also sheet 1
L6470_MISO: U13.18(SDO) ; also sheet 1
L6470_MOSI: U6.20(SDI) ; also sheet 1
L6470_RST: U6.3(STBYN/RESETN) U7.3(STBYN/RESETN) U8.3(STBYN/RESETN) U9.3(STBYN/RESETN) U10.3(STBYN/RESETN) U11.3(STBYN/RESETN) U12.3(STBYN/RESETN) U13.3(STBYN/RESETN) ; also sheet 1
L6470_SCK: U6.19(CK) U7.19(CK) U8.19(CK) U9.19(CK) U10.19(CK) U11.19(CK) U12.19(CK) U13.19(CK) ; also sheet 1
N$20: C40.2 U6.10(CP)
N$21: C40.1 D14.3(COM)
N$22: C65.1 D14.2(C2) U6.11(VBOOT)
N$23: R14.1 U6.4(SW)
N$24: BUSY1.A RN6.8
N$29: FLAG1.A RN6.7
N$30: C44.2 CN5.2 R14.2 TP30.P$1
N$31: CN1.1 J5.1 U6.1(OUT1A)
N$32: CN1.2 J5.2 U6.28(OUT2A)
N$35: CN1.4 J5.4 U6.14(OUT1B)
N$37: CN1.3 J5.3 U6.15(OUT2B)
N$39: TP26.P$1 U6.18(SDO) U7.20(SDI)
N$60: C41.2 U7.10(CP)
N$61: C41.1 D15.3(COM)
N$63: C67.1 D15.2(C2) U7.11(VBOOT)
N$64: R15.1 U7.4(SW)
N$65: BUSY2.A RN6.5
N$66: FLAG2.A RN6.6
N$67: C45.2 CN6.2 R15.2 TP31.P$1
N$68: CN2.1 J6.1 U7.1(OUT1A)
N$69: CN2.2 J6.2 U7.28(OUT2A)
N$70: CN2.4 J6.4 U7.14(OUT1B)
N$71: CN2.3 J6.3 U7.15(OUT2B)
N$73: TP27.P$1 U7.18(SDO) U8.20(SDI)
N$87: C42.2 U8.10(CP)
N$88: C42.1 D16.3(COM)
N$89: C69.1 D16.2(C2) U8.11(VBOOT)
N$90: R16.1 U8.4(SW)
N$91: BUSY3.A RN7.8
N$92: FLAG3.A RN7.7
N$93: C46.2 CN7.2 R16.2 TP32.P$1
N$94: CN3.1 J7.1 U8.1(OUT1A)
N$95: CN3.2 J7.2 U8.28(OUT2A)
N$96: CN3.4 J7.4 U8.14(OUT1B)
N$97: CN3.3 J7.3 U8.15(OUT2B)
N$99: TP25.P$1 U8.18(SDO) U9.20(SDI)
N$113: C43.2 U9.10(CP)
N$114: C43.1 D17.3(COM)
N$115: C71.1 D17.2(C2) U9.11(VBOOT)
N$116: R17.1 U9.4(SW)
N$117: BUSY4.A RN7.5
N$118: FLAG4.A RN7.6
N$119: C47.2 CN8.2 R17.2 TP29.P$1
N$120: CN4.1 J8.1 U9.1(OUT1A)
N$121: CN4.2 J8.2 U9.28(OUT2A)
N$122: CN4.4 J8.4 U9.14(OUT1B)
N$123: CN4.3 J8.3 U9.15(OUT2B)
N$125: TP28.P$1 U9.18(SDO) U10.20(SDI)
N$139: C80.2 U10.10(CP)
N$140: C80.1 D26.3(COM)
N$141: C105.1 D26.2(C2) U10.11(VBOOT)
N$145: R18.1 U10.4(SW)
N$146: BUSY5.A RN8.8
N$147: FLAG5.A RN8.7
N$148: C84.2 CN13.2 R18.2 TP36.P$1
N$149: CN9.1 J9.1 U10.1(OUT1A)
N$150: CN9.2 J9.2 U10.28(OUT2A)
N$151: CN9.4 J9.4 U10.14(OUT1B)
N$152: CN9.3 J9.3 U10.15(OUT2B)
N$154: TP33.P$1 U10.18(SDO) U11.20(SDI)
N$168: C81.2 U11.10(CP)
N$169: C81.1 D27.3(COM)
N$170: C107.1 D27.2(C2) U11.11(VBOOT)
N$171: R19.1 U11.4(SW)
N$172: BUSY6.A RN8.5
N$173: FLAG6.A RN8.6
N$174: C85.2 CN14.2 R19.2 TP37.P$1
N$175: CN10.1 J10.1 U11.1(OUT1A)
N$176: CN10.2 J10.2 U11.28(OUT2A)
N$177: CN10.4 J10.4 U11.14(OUT1B)
N$178: CN10.3 J10.3 U11.15(OUT2B)
N$180: TP35.P$1 U11.18(SDO) U12.20(SDI)
N$194: C82.2 U12.10(CP)
N$195: C82.1 D28.3(COM)
N$196: C109.1 D28.2(C2) U12.11(VBOOT)
N$197: R20.1 U12.4(SW)
N$198: BUSY7.A RN9.8
N$199: FLAG7.A RN9.7
N$200: C86.2 CN15.2 R20.2 TP38.P$1
N$201: CN11.1 J11.1 U12.1(OUT1A)
N$202: CN11.2 J11.2 U12.28(OUT2A)
N$203: CN11.4 J11.4 U12.14(OUT1B)
N$204: CN11.3 J11.3 U12.15(OUT2B)
N$206: TP34.P$1 U12.18(SDO) U13.20(SDI)
N$220: C83.2 U13.10(CP)
N$221: C83.1 D29.3(COM)
N$222: C111.1 D29.2(C2) U13.11(VBOOT)
N$223: R21.1 U13.4(SW)
N$224: BUSY8.A RN9.5
N$225: FLAG8.A RN9.6
N$226: C87.2 CN16.2 R21.2 TP39.P$1
N$227: CN12.1 J12.1 U13.1(OUT1A)
N$228: CN12.2 J12.2 U13.28(OUT2A)
N$229: CN12.4 J12.4 U13.14(OUT1B)
N$230: CN12.3 J12.3 U13.15(OUT2B)
OSCOUT2: U6.8(OSCOUT) U7.7(OSCIN)
OSCOUT4: U7.8(OSCOUT) U8.7(OSCIN)
OSCOUT6: U8.8(OSCOUT) U9.7(OSCIN)
OSCOUT8: U9.8(OSCOUT) U10.7(OSCIN)
OSCOUT10: U10.8(OSCOUT) U11.7(OSCIN)
OSCOUT12: U11.8(OSCOUT) U12.7(OSCIN)
OSCOUT14: U12.8(OSCOUT) U13.7(OSCIN)
OSCOUT16: U13.8(OSCOUT)
QGOUT1: Q3.3(OUT) U6.7(OSCIN)
Unconnected: Q3.1(EN) U6.25(STCK) U7.25(STCK) U8.25(STCK) U9.25(STCK) U10.25(STCK) U11.25(STCK) U12.25(STCK) U13.25(STCK)

### Notes on the sheet
- Switch
  Input
- Switch
  Input
- Switch
  Input
- Switch
  Input
- Switch
  Input
- Switch
  Input
- Switch
  Input
- Switch
  Input

## Power pins joined to a net without a drawn wire
NC: IC1.12(NC)
RSVD1: IC1.38(RSVD1)
RSVD2: IC1.39(RSVD2)
RSVD3: IC1.40(RSVD3)

## Library data of the parts
3.3V = Seeed-LED:SMD-LED-CLEAR-GREEN(0603): 304090043; MPN: 19-217-G7C-AN1P2-3T
BUSY1-BUSY8 = SparkFun-LED:LED-GREEN: Various green LEDs Green LEDs used in SFE Production 0603- DIO-00821 LARGE- DIO-00862 LILYPAD- DIO-09910; PROD_ID: DIO-00821
C1 C3 C7-C10 C12-C17 C20 C21 C24 C31-C35 C72-C75 = Seeed-Capacitor:CERAMIC-100NF-25V-10%-X7R(0402): 302010024; MPN: CC0402KRX7R8BB104
C2 = OPL_Capacitor:CERAMIC-10UF-25V-10%-X5R(1206): 302010181; MPN: CC1206KKX5R8BB106; VALUE: 10uf
C4 C5 C25 C26 = Seeed-Capacitor:CERAMIC-15PF-50V-5%-NPO(0402): 302010041; MPN: GRM1555C1H150JA01D; VALUE: 15pf
C6 = OPL_Capacitor:CERAMIC-22UF-16V-10%-X7R(1206): 302010182
C11 = OPL_Capacitor:CERAMIC-10UF-10V-(-20%～+80%)-Y5V(0805): 302010158; MPN: CC0805ZKY5V6BB106; VALUE: 10uf
C18 C19 = Seeed-Capacitor:CERAMIC-100UF-6.3V-20%-X5R(1206): 302010183; MPN: GRM31CR60J107ME39L; VALUE: 100uf
C22 = Seeed-Capacitor:CERAMIC-4.7UF-10V-10%-X5R(0603): 302010111; MPN: CC0603KRX5R6BB475; VALUE: 4.7uf
C23 C28 = OPL_Capacitor:CERAMIC-10NF-50V-10%-X7R(0603): 302010140; MPN: CC0603KRX7R9BB103
C27 = Seeed-Capacitor:CERAMIC-22NF-50V-10%-X7R(0402): 302010242; MPN: CC0402KRX7R9BB223; VALUE: 22NF 50V
C29 C30 = Seeed-Capacitor:CERAMIC-4.7NF-50V-10%-X7R(0402): 302010261; MPN: CC0402KRX7R9BB472; VALUE: 4.7NF 50V
C36-C39 C76-C79 = Seeed-Capacitor:CERAMIC-10UF-25V-10%-X5R(0805): 302010178; MPN: CC0805KKX5R8BB106; VALUE: 10uf
C40-C43 C80-C83 = Seeed-Capacitor:CERAMIC-220NF-25V-10%-X7R(0603): 302010073; MPN: CC0603KRX7R8BB224; VALUE: 220nf
C44 = Seeed-Capacitor:CERAMIC-10NF-50V-10%-X7R(0402): 302010006; MPN: CC0402KRX7R9BB103
C45-C47 C84-C87 = Seeed-Capacitor:CERAMIC-10NF-50V-10%-X7R(0402): 302010006; MPN: CC0402KRX7R9BB103; VALUE: 10nf
C48-C51 C88-C91 = _kantaParts:C_POL: Nippon Chemi-Con 3300uF/50V KMH50VSSN3300M P-01590 <http://akizukidenshi.com/catalog/g/gP-01590/>
C52-C64 C66 C68 C70 C92-C104 C106 C108 C110 = Seeed-Capacitor:CERAMIC-100NF-50V-10%-X7R(0603): 302010138; MPN: CC0603KRX7R9BB104
C65 C67 C69 C71 C105 C107 C109 C111 = OPL_Capacitor:CERAMIC-220NF-25V-10%-X7R(0603): 302010073; MPN: CC0603KRX7R8BB224
CN1-CN4 CN9-CN12 = jst-xa:B4B-XASK-1: Wire-to-Board 2.5mm pitch top mount connector Source: http://www.jst-mfg.com/product/pdf/jpn/XA1.pdf http://www.jst-mfg.com/product/detail.php?series=272
CN5-CN8 CN13-CN16 = jst-xa:B3B-XASK-1: Wire-to-Board 2.5mm pitch top mount connector Source: http://www.jst-mfg.com/product/pdf/jpn/XA1.pdf http://www.jst-mfg.com/product/detail.php?series=272
D4 = SparkFun-DiscreteSemi:DIODE-ZENER: Zener Diode A Zener diode allows current to flow from its anode to its cathode like a normal semiconductor diode, but it also permits current to flow in the reverse direction when its "Zener voltage" is reached. - WIkipedia; PROD_ID: DIO-11284; VALUE: 3.3V
D14-D17 D26-D29 = SparkFun-DiscreteSemi:BAV99: Series-pair diode array Two small signal silicon diodes connected anode to cathode. Connections to all three nodes available. Link to datasheet <https://www.fairchildsemi.com/datasheets/BA/BAV99.pdf> SparkFun Products: SparkFun AutoDriver <https://www.sparkfun.com/products/13752>; PROD_ID: DIO-10647; VALUE: 200mA/70V
FD1-FD3 = SparkFun-Aesthetics:FIDUCIAL: Fiducial Alignment Points Various fiducial points for machine vision alignment.
FLAG1-FLAG8 = SparkFun-LED:LED-RED: Assorted Red LEDs LilyPad 1206- DIO-09912 1206- DIO-00809 0603- DIO-00819 "SMART" means more efficient and expensive; PROD_ID: DIO-00819
IC1 = _kantaParts:0982_W5500: The W5500 chip is a Hardwired TCP/IP embedded Ethernet controller that enables easier internet connection for embedded systems using SPI (Serial Peripheral Interface). Case TQFP48
ID = switch-dil:219-08*: Surface Mount DIP Switch Series 219 SMT CTS Electronic Components Sourc: www.ctscorp.com; OC_FARNELL: unknown; OC_NEWARK: unknown
J1 = PonoorExperiments:POWERJACK
J2 = Wurth_Connectors_WR-BHD:6120XX21621_61201021621: WR-BHD 2.54 mm Male Box Header KIND PROPERTIES: Pitch 2.54 mm Gender:Male MATERIAL PROPERTIES: Insulator Material:PBT Insulator Flammability Rating UL94 V-0 Insulator Color:Black Contact Material :Copper Alloy Contact Plating :Gold Contact Type: Stamped GENERAL INFORMATION: Operating Temperature:-40 °C up to +125 °C Compliance:RoHS Working Voltage: 250 V (AC) Withstanding Voltage:500 V (AC) Contact Resistance: 20 mΩ Insulation Resistance:1000 MΩ CERTIFICATION: UL Approval:E323964 PACKAGING PROPERTIES Packaging :Tray <https://katalog.we-online.com/media/images/v2/o32884v209%20Family_WR-BHD_6120xx21621.jpg> Details see: https://katalog.we-online.com/en/em/BHD_2_54_MALE_BOX_HEADER_6120XX21621 Updated by Yingchun,Shan 2019-10-29 2019 (C) Würth Elektronik; CONTACT-RESISTANCE: 20mOhm; DATASHEET-URL: https://katalog.we-online.com/em/datasheet/61201021621.pdf; GENDER: Male; IR: 3A; L: 20.36mm; MATES: WR-BHD 2.54mm Female IDC Connector with Strain Relief; MOUNT: THT; PACKAGING: Tray; PART-NUMBER: 61201021621; PINS: 10; PITCH: 2.54mm; TOL-R: max.; TYPE: Straight; WORKING-VOLTAGE: 250V(AC)
J3 = PonoorExperiments:CONN_06
J4 = PonoorExperiments:SDCARD_SLOT: SD/microSD card slot
J5-J12 = 691321300004:691321300004: WR-TBL Serie 321 - 3.81mm Vertical PCB Header , 4 Pins=>Code : Con_TBL_Pluggable_3.81_PCB_THT_Simple_691321300004 <http://katalog.we-online.de/media/images/eican/Con_TBL_Pluggable_3.81_PCB_THT_Simple_6913213000xx_pf2.jpg> Details see: http://katalog.we-online.de/en/em/TBL_3_81_321_VERTICAL_PCB_HEADER_6913213000XX Created 2014-06-19, Karrer Zheng 2014 (C) Würth Elektronik; AVAILABILITY: Unavailable; DESCRIPTION: 321; 3.81mm Pitch Straight Pluggable Term Block, PCB Header, Through Hole, 4 Way; MF: Wurth Electronics; MP: 691321300004; PACKAGE: None; PRICE: None
L = Seeed-LED:SMD-LED-CLEAR-BLUE(0603): 304090045; MPN: 19-217-BHC-ZL1M2RY-3T
L1 L2 = Seeed-Inductor:SMD-FERRITE-BEAD-330R-1500MA(0805): 303030006; MPN: BLM21PG331SN1D
PS1 = P78E05-1000:P78E05-1000: NON-ISOLATED DC SWITCHING REGULATOR; CUI_PURCHASE_URL: https://www.cui.com/product/dc-dc-converters/non-isolated/p78e-1000-series?utm_source=snapeda.com&utm_medium=referral&utm_campaign=snapedaBOM; DESCRIPTION: 1 A Output Current, 6~36 Vdc Input, 3 Pin SIP, Non-Isolated, Dc-Dc Converter; DIGI-KEY_PART_NUMBER: 102-5018-ND; DIGI-KEY_PURCHASE_URL: https://www.digikey.jp/product-detail/en/cui-inc/P78E05-1000/102-5018-ND/9649654?utm_source=snapeda&utm_medium=aggregator&utm_campaign=symbol; MF: CUI Inc.; MP: P78E05-1000; PACKAGE: SIP-3 CUI Inc.
Q1 = transistor-fet:FDD4141: P-Channel PowerTrench® MOSFET Source: FDD4141.pdf
Q2 = _kantaParts:CRYSTAL: CRYSTAL
Q3 = _kantaParts:CRYSTAL_OSC
R1 R2 = OPL_Resistor:SMD-RES-5.1K-1%-1/10W(0603): 301012088; MPN: RC0603FR-071K5L; VALUE: 1.5K
R3 R5 R9 = Seeed-Resistor:SMD-RES-10K-5%-1/10W(0603): 301010293; MPN: RC0603JR-0710KL; VALUE: 10K 1/10W
R4 = Seeed-Resistor:SMD-RES-100K-5%-1/10W(0603): 301010089; MPN: RC0603JR-07100KL
R6 R7 = OPL_Resistor:SMD-RES-4.7K-5%-1/10W(0603): 301010290; MPN: RC0603JR-074K7L
R8 = Seeed-Resistor:SMD-RES-12K-1%-1/10W(0603): 301010102; MPN: RC0603FR-0712KL; VALUE: 12K
R10 = Seeed-Resistor:SMD-RES-1M-5%-1/10W(0603): 301010100; MPN: RC0603JR-071ML
R11 = Seeed-Resistor:SMD-RES-10R-5%-1/10W(0603): 301010096; MPN: RC0603JR-0710RL
R12 R13 = Seeed-Resistor:SMD-RES-330R-1%-1/10W(0603): 301010300; MPN: RC0603FR-07330RL
R14-R21 = Seeed-Resistor:SMD-RES-100R-5%-1/10W(0603): 301010090; MPN: RC0603JR-07100RL
R22 = OPL_Resistor:SMD-RES-330R-1%-1/10W(0603): 301010300; MPN: RC0603FR-07330RL
RESET = PonoorExperiments:SWITCH-SPST-2
RN1-RN9 = _kantaParts:4R-N: Array Chip Resistor Source: RS Component / Phycomp
RX = Seeed-LED:LED-SMD-RED-DIFFUSED(0603): 304090042; MPN: 19-217-R6C-AL1M2VY-3T
S2-S5 = SparkFun-Electromechanical:STANDOFF_ELECTRICAL: A standoff intended to be an electrically connected point. Pad size and stop size allow for a #4 Phillips pan screw head to make a solid connection to the board.
SWD = _kantaParts:CORTEX_DEBUG
TP1-TP5 TP14-TP39 = SparkFun-Connectors:TEST-POINT: SparkFun Test Points Bare copper test points for troubleshooting or In-Circuit-Testing. These are used by our Production team for verifying production board runs using pogo-pins on test beds. SparkFun Products: SparkFun LSM9DS1 Breakout <https://www.sparkfun.com/products/13284> SparkFun PSOC <https://www.sparkfun.com/products/13714> SparkFun Load Cell Amplifier <https://www.sparkfun.com/products/13879>
TP6-TP13 TP40-TP42 = PonoorExperiments:TESTPOINT
TX = Seeed-LED:SMD-LED-CLEAR-YELLOW(0603): 304090044; MPN: 19-217-Y5C-AM1N1VY-3T
U1 = IC:74*165: 8-bit parallel-in/serial out shift register http://www.nxp.com/documents/data_sheet/74HC_HCT165.pdf
U2 = _kantaParts:USBLC6: STMicroelectronics USBLC6 VERY LOW CAPACITANCE ESD PROTECTION RS 624-7693 <http://jp.rs-online.com/web/p/tvs/6247693/>
U3 = SparkFun-IC-Logic:74*595: 8-Bit Shift Register (Serial to Parallel) Datasheet <http://cdn.sparkfun.com/datasheets/BreakoutBoards/MM74HC595.pdf> SparkFun Products SparkFun Shift Register Breakout - 74HC595 <https://www.sparkfun.com/products/10680> (BOB-10680)
U4 = SparkFun-IC-Power:V_REG_LM1117: Voltage Regulator LM1117 Standard adjustable voltage regulator but in SMD form. Spark Fun Electronics SKU : COM-00595; PROD_ID: VREG-08170
U5 = samd21-temp:ATSAMD21G: Atmel SAMD21G SMART ARM-Based Microcontroller The Atmel ® | SMART ™ SAM D21 is a series of low-power microcontrollers using the 32-bit ARM ® Cortex ® -M0+ processor, and ranging from 32- to 64-pins with up to 256KB Flash and 32KB of SRAM. The SAM D21 devices operate at a maximum frequency of 48MHz and reach 2.46 CoreMark/MHz. They are designed for simple and intuitive migration with identical peripheral modules, hex compatible code, identical linear address map and pin compatible migration paths between all devices in the product series. All devices include intelligent and flexible peripherals, Atmel Event System for inter-peripheral signaling, and support for capacitive touch button, slider and wheel user interfaces.; PROD_ID: IC-13064
U6-U13 = _kantaParts:L6470
USB1 = USB-C-U262-161N-4BVC11:USB-C_USB2.0-TYPE-C
X1 = PonoorExperiments:CONN_02
X2 = SmartPrj:CRYSTAL-3.2-2.5
X3 = _kantaParts:RJ45_MAGNETICS_LED